# Altium schematic sheet Peripherals.SchDoc
size A; SheetNumber: 1; SheetTotal: 2; SPICEModelCacheRTTYEORK: <root> / <DocumentId>RTTYEORK</DocumentId> / <CacheFrame Number="0"> / <Model Name="led2" Kind="MDL"> / <Text>*Typ RED,GREEN,YELLOW,AMBER GaAs LED: Vf=2.1V Vr=4V If=40mA trr=3uS / *LED Pinout: 1=A, 2=K / .MODEL LED2 D (IS=93.1P RS=42M N=4.61 BV=4 IBV=10U / + CJO=2.97P VJ=.75 M=.333 TT=4.32U)</Text> / </Model> / <Model Name="skydiode" Kind="MDL"> / <Text>*Default Schottky Diode / *Schottky Diode Pinout: A,K / .MODEL SKYDIODE D(EG=0.69 XTI=2)</Text> / </Model> / <Model Name="865060643005_10uf" Kind="CKT"> / <Text>******* / .subckt 865060643005_10uF 1 2 / Rser 1 3 0.86 / Lser 2 4 0.000000002536 / C1 3 4 0.00001 / Rpar 3 4 10000000 / .ends 865060643005_10uF</Text> / </Model> / </CacheFrame> / </root>
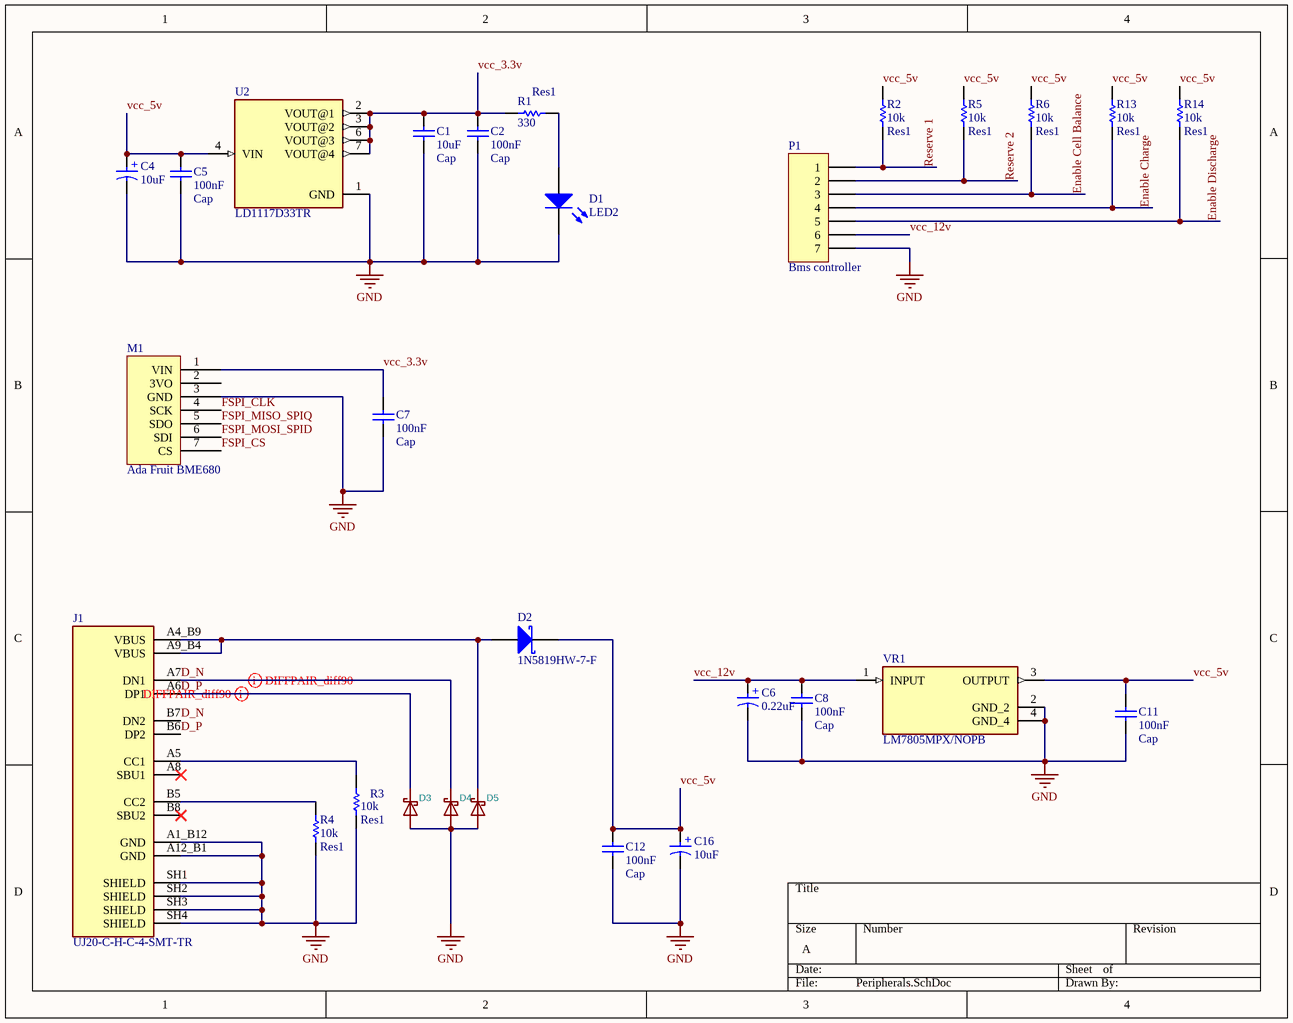
[diagram p0: Peripherals.SchDoc]

## Parts
C1  Cap  value 10uF  [6-0805_L]
C2  Cap  value 100nF  [6-0805_L]
C4  10uF  [WCAP-ASLL_D6.3H5.5]
C5  Cap  value 100nF  [6-0805_L]
C6  0.22uF  [WCAP-ASLL_D6.3H5.5]
C7  Cap  value 100nF  [6-0805_L]
C8  Cap  value 100nF  [6-0805_L]
C11  Cap  value 100nF  [6-0805_L]
C12  Cap  value 100nF  [6-0805_L]
C16  10uF  [WCAP-ASLL_D6.3H5.5]
D1  LED2  [6-0805_N]
D2  1N5819HW-7-F  [SMB]
D3  Schottky-Diode  [SOD-523]  (value not drawn)
D4  Schottky-Diode  [SOD-523]  (value not drawn)
D5  Schottky-Diode  [SOD-523]  (value not drawn)
J1  UJ20-C-H-C-4-SMT-TR  [CUI_UJ20-C-H-C-4-SMT-TR]
M1  Ada Fruit BME680  [Ada Fruit BME680]
P1  Bms controller  [HDR1X7]
R1  Res1  value 330  [6-0805_N]
R2  Res1  value 10k  [6-0805_N]
R3  Res1  value 10k  [6-0805_N]
R4  Res1  value 10k  [6-0805_N]
R5  Res1  value 10k  [6-0805_N]
R6  Res1  value 10k  [6-0805_N]
R13  Res1  value 10k  [6-0805_N]
R14  Res1  value 10k  [6-0805_N]
U2  LD1117D33TR  [SOIC127P600X175-8N]
VR1  LM7805MPX/NOPB  [VREG_LM7805MPX/NOPB]

## Nets
GND: C1.1 C2.1 C4.2(N) C5.1 C6.2(N) C7.1 C8.1 C11.1 C12.1 C16.2(N) D1.2(K) D3.A D4.A D5.A J1.A1_B12(GND) J1.A12_B1(GND) J1.SH1(SHIELD) J1.SH2(SHIELD) J1.SH3(SHIELD) J1.SH4(SHIELD) M1.3(GND) P1.7 R3.1 R4.1 U2.1(GND) VR1.2(GND_2) VR1.4(GND_4)
D_N: D4.K J1.A7(DN1) J1.B7(DN2)
D_P: D3.K J1.A6(DP1) J1.B6(DP2)
Enable Cell Balance: P1.3 R6.1
Enable Charge: P1.4 R13.1
Enable Discharge: P1.5 R14.1
FSPI_CLK: M1.4(SCK)
FSPI_CS: M1.7(CS)
FSPI_MISO_SPIQ: M1.5(SDO)
FSPI_MOSI_SPID: M1.6(SDI)
Reserve 1: P1.1 R2.1
Reserve 2: P1.2 R5.1
vcc_3.3v: C1.2 C2.2 C7.2 M1.1(VIN) R1.1 U2.2(VOUT@1) U2.3(VOUT@2) U2.6(VOUT@3) U2.7(VOUT@4)
vcc_5v: C4.1(P) C5.2 C11.2 C12.2 C16.1(P) D2.2(K) R2.2 R5.2 R6.2 R13.2 R14.2 U2.4(VIN) VR1.3(OUTPUT)
vcc_12v: C6.1(P) C8.2 P1.6 VR1.1(INPUT)
NetD1_1: D1.1(A) R1.2
NetD2_1: D2.1(A) D5.K J1.A4_B9(VBUS) J1.A9_B4(VBUS)
NetJ1_A5: J1.A5(CC1) R3.2
NetJ1_B5: J1.B5(CC2) R4.2

Not connected (* = marked no-connect by the designer): J1 A8(SBU1)* B8(SBU2)*; M1 2(3VO)

## Layout directives
differential pair; differential pair class diff90: D_N, D_P

## Notes on the sheet
- (in symbol 865060643005) +

## Library data of the parts
C1 C2 C5 C7 C8 C11 C12 = Cap: Capacitor; Published: 8-Jun-2000; LatestRevisionDate: 17-Jul-2002; LatestRevisionNote: Re-released for DXP Platform.; PackageReference: RAD-0.3; Publisher: Altium Limited; PackageDescription: Radial Cap, Thru-Hole; 2 Leads; 0.3 in Pin Spacing
C4 C6 C16 = 865060643005: WCAP-ASLL Aluminum Electrolytic Capacitor, V-Chip, SMT, D6.3 x H5.5mm, 10uF, 50V; Manufacturer: Wurth Elektronik; Capacitance Tolerance: +/-20%; Dissipation Factor: 12%; Endurance: 2000h; Leakage Current: 5uA; Ripple Current: 165mA; Technical Reference: ASED055100M050DVCTBB000; Manufacturer Part Number: 865060643005; Category: Aluminum Electrolytic Capacitors; Match Code: WCAP-ASLL; ComponentLink1Description: Website Link; ComponentLink1URL: https://www.we-online.com/redexpert/article/865060643005?ad; ComponentLink2Description: Datasheet Link; ComponentLink2URL: https://www.we-online.com/redexpert/spec/865060643005?ad; Mount: Surface Mount; Operating Temperature Max: 105°C; Operating Temperature Min: -55°C; Packaging: Tape and Reel; Height: 5.5mm; Diameter: 6.3mm; Capacitance: 10uF; Rated Voltage (DC): 50V
D1 = LED2: Typical RED, GREEN, YELLOW, AMBER GaAs LED; Published: 8-Jun-2000; LatestRevisionDate: 17-Jul-2002; LatestRevisionNote: Re-released for DXP Platform.; PackageVersion: Feb-2002; PackageReference: 3.2X1.6X1.1; Publisher: Altium Limited; PackageDescription: SM LED; 2 Flat Leads
D2 = D Schottky: Schottky Diode; Published: 8-Jun-2000; LatestRevisionDate: 17-Jul-2002; LatestRevisionNote: Re-released for DXP Platform.; PackageReference: SMB; Publisher: Altium Limited; PackageDescription: DO-214-AA/SMB; 2 C-Bend Leads; Body 5.3 x 3.6 mm, inc. leads (LxW); Code_JEDEC: DO-214-AA
D3-D5 = Schottky-Diode: ki_description: Schottky Diode; Value: Shottky-Diode; Reference: D; Datasheet: https://diotec.com/de/produktliste/SBD.html; ki_keywords: Schottky
M1 = Ada Fruit BME680: BME680 sensor module
P1 = Header 7: Header, 7-Pin; LatestRevisionDate: 17-Jul-2002; LatestRevisionNote: Re-released for DXP Platform.; Publisher: Altium Limited
R1-R6 R13 R14 = Res1: Resistor; Published: 8-Jun-2000; LatestRevisionDate: 17-Jul-2002; LatestRevisionNote: Re-released for DXP Platform.; PackageReference: AXIAL-0.3; Publisher: Altium Limited; PackageDescription: Axial Device, Thru-Hole; 2 Leads; 0.3 in Pin Spacing
U2 = LD1117D33TR: Linear Voltage Regulator IC Positive Fixed 1 Output 800mA 8-SOIC; MF: STMicroelectronics; SnapEDA_Link: https://www.snapeda.com/parts/LD1117D33TR/STMicroelectronics/view-part/?ref=snap; Package: SO-8 STMicroelectronics; Value: *; MP: LD1117D33TR; Check_prices: https://www.snapeda.com/parts/LD1117D33TR/STMicroelectronics/view-part/?ref=eda
VR1 = LM7805MPX/NOPB: 1.5-A, 30-V, linear voltage regulator 4-SOT-223 0 to 125; Price: None; Value: *; Package: None; Availability: Unavailable; MP: LM7805MPX/NOPB
J1 = UJ20-C-H-C-4-SMT-TR: Package: None; Price: None; Value: *; MP: UJ20-C-H-C-4-SMT-TR; Availability: Unavailable